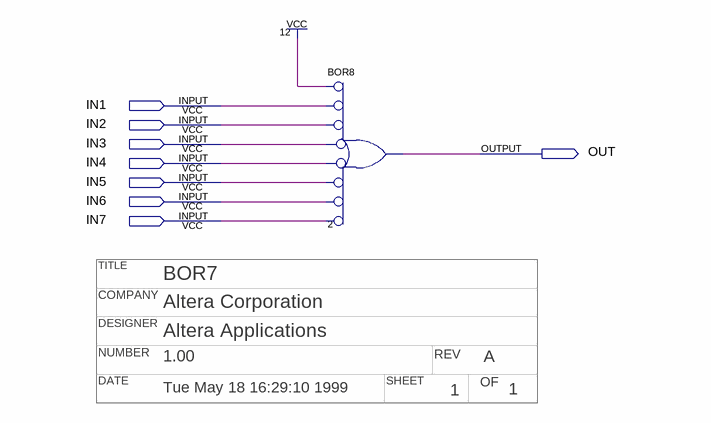
[diagram p0: schematic sheet]
// Quartus schematic bor7.bdf as structural Verilog: 1 symbols, 8 pins
// Title block: TITLE: BOR7; COMPANY: Altera Corporation; DESIGNER: Altera Applications; NUMBER: 1.00; REV: A; DATE: Tue May 18 16:29:10 1999; SHEET: 1; OF: 1
module bor7 (
  input  IN1,
  input  IN2,
  input  IN3,
  input  IN4,
  input  IN5,
  input  IN6,
  input  IN7,
  output OUT
);

  or u_2 (OUT, ~1'b1, ~IN1, ~IN2, ~IN3, ~IN4, ~IN5, ~IN6, ~IN7);  // BOR8
endmodule
